# EAGLE design 14DoF (EAGLE 6.2)
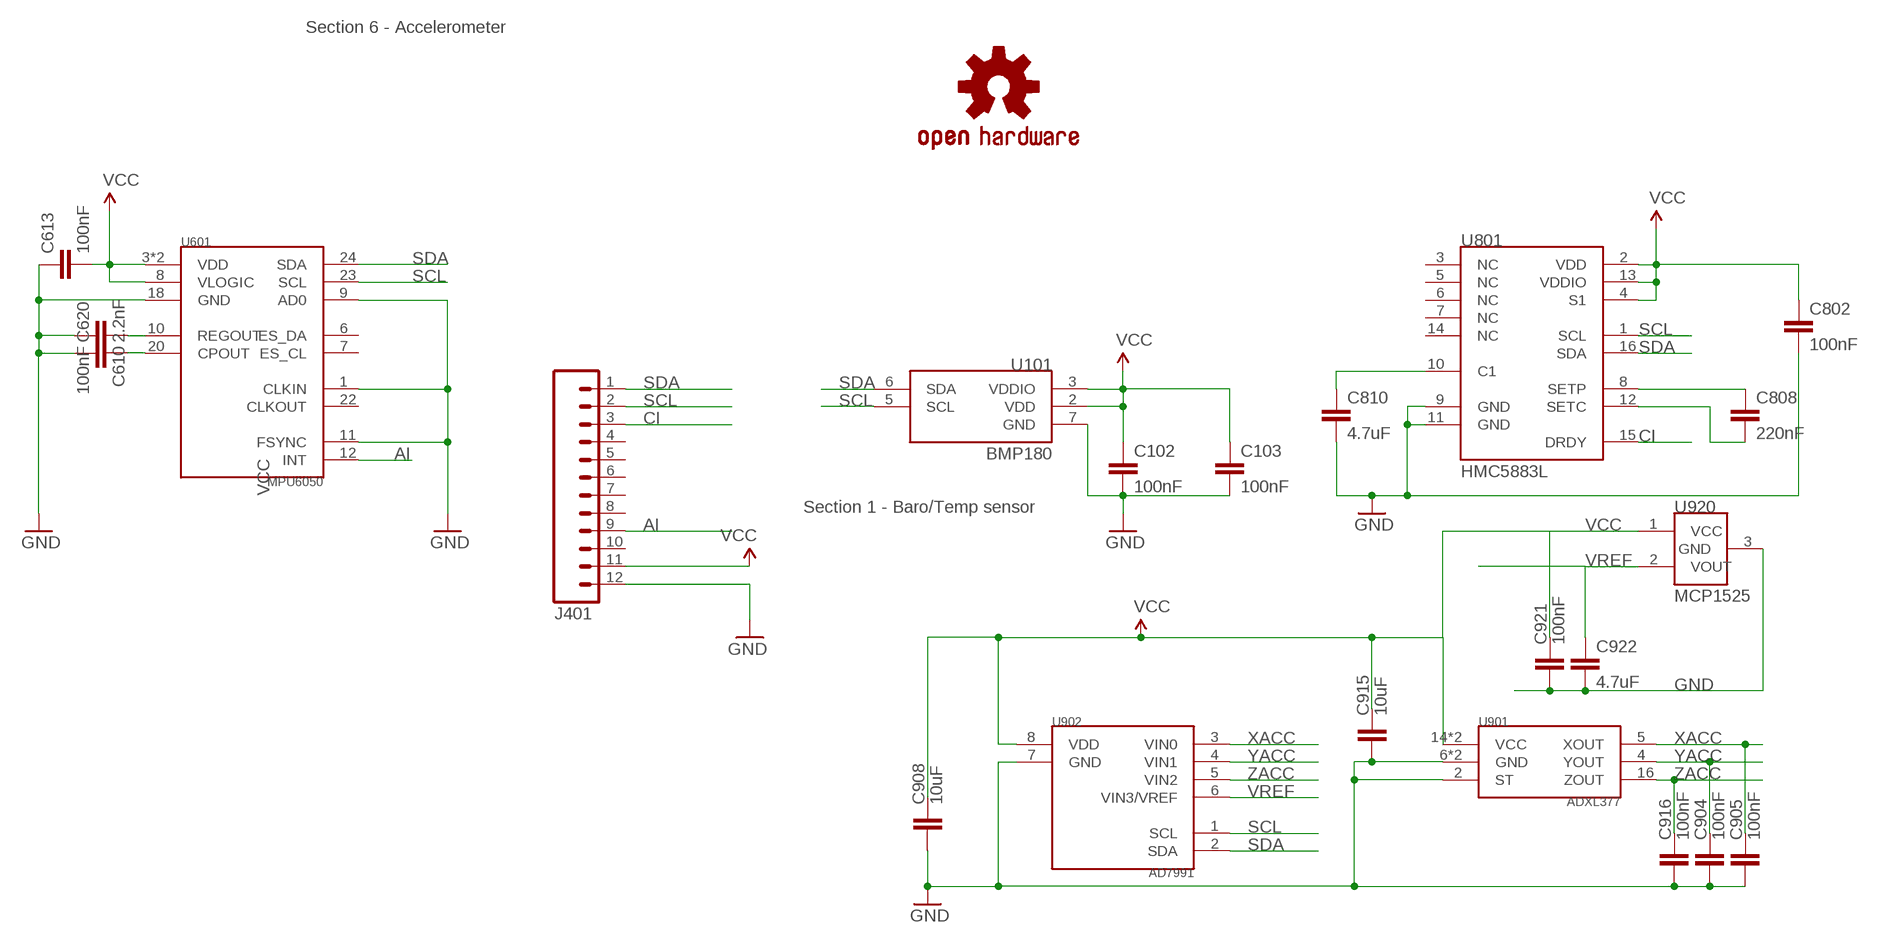
[diagram p0: schematic, sheet 1]

## Parts
C102  100nF  CAP0603-CAP  [0603-CAP]
C103  100nF  CAP0603-CAP  [0603-CAP]
C610  100nF  CAP0603-CAP  [0603-CAP]
C613  100nF  CAP0603-CAP  [0603-CAP]
C620  2.2nF  CAP0603-CAP  [0603-CAP]
C802  100nF  CAP0603-CAP  [0603-CAP]
C808  220nF  CAP0603-CAP  [0603-CAP]
C810  4.7uF  CAP0603-CAP  [0603-CAP]
C904  100nF  CAP0603-CAP  [0603-CAP]
C905  100nF  CAP0603-CAP  [0603-CAP]
C908  10uF  CAP0603-CAP  [0603-CAP]
C915  10uF  CAP0603-CAP  [0603-CAP]
C916  100nF  CAP0603-CAP  [0603-CAP]
C921  100nF  CAP0603-CAP  [0603-CAP]
C922  4.7uF  CAP0603-CAP  [0603-CAP]
J401  M12PTH  [1X12]
U101  BMP180  [BMP180]
U601  MPU6050  [MPU60X0]
U801  HMC5883L  HMC5883LSMD  [16LPCC]
U901  ADXL377  [ADXL377]
U902  AD7991  AD799X  [SOT-23-8]
U920  MCP1525  [SOT-23-3]
U$2  OSHW-LOGOS  [OSHW-LOGO-S]

## Nets
AI: J401.9 U601.12(INT)
CI: J401.3 U801.15(DRDY)
GND: C102.2 C103.2 C610.2 C613.1 C620.1 C802.2 C810.2 C904.2 C905.2 C908.2 C915.2 C916.2 C921.2 C922.2 J401.12 U101.7(GND) U601.1(CLKIN) U601.9(AD0) U601.11(FSYNC) U601.18(GND) U801.9(GND) U801.11(GND) U901.2(ST) U901.6(GND) U901.7(GND) U902.7(GND) U920.3(GND)
N$1: C610.1 U601.10(REGOUT)
N$3: C620.2 U601.20(CPOUT)
N$14: C808.1 U801.8(SETP)
N$15: C808.2 U801.12(SETC)
N$16: C810.1 U801.10(C1)
SCL: J401.2 U101.5(SCL) U601.23(SCL) U801.1(SCL) U902.1(SCL)
SDA: J401.1 U101.6(SDA) U601.24(SDA) U801.16(SDA) U902.2(SDA)
VCC [power]: C102.1 C103.1 C613.2 C802.1 C908.1 C915.1 C921.1 J401.11 U101.2(VDD) U101.3(VDDIO) U601.3(VDD) U601.8(VLOGIC) U601.13(VDD) U801.2(VDD) U801.4(S1) U801.13(VDDIO) U901.14(VCC) U901.15(VCC) U902.8(VDD) U920.1(VCC)
VREF: C922.1 U902.6(VIN3/VREF) U920.2(VOUT)
XACC: C905.1 U901.5(XOUT) U902.3(VIN0)
YACC: C904.1 U901.4(YOUT) U902.4(VIN1)
ZACC: C916.1 U901.16(ZOUT) U902.5(VIN2)
Unconnected: J401.4 J401.5 J401.6 J401.7 J401.8 J401.10 U601.6(ES_DA) U601.7(ES_CL) U601.22(CLKOUT) U801.3(NC) U801.5(NC) U801.6(NC) U801.7(NC) U801.14(NC)

## Notes on the sheet
- Section 6 - Accelerometer
- Section 1 - Baro/Temp sensor

## Library data of the parts
C102 C103 C610 C613 C802 C904 C905 C916 = SparkFun:CAP: Capacitor Standard 0603 ceramic capacitor, and 0.1" leaded capacitor.; DIGIKEY: 445-1316-1-ND
C620 = SparkFun:CAP: Capacitor Standard 0603 ceramic capacitor, and 0.1" leaded capacitor.; DIGIKEY: 445-1311-1-ND
C808 = SparkFun:CAP: Capacitor Standard 0603 ceramic capacitor, and 0.1" leaded capacitor.; DIGIKEY: 445-5132-1-ND
C810 = SparkFun:CAP: Capacitor Standard 0603 ceramic capacitor, and 0.1" leaded capacitor.; DIGIKEY: 445-7483-1-ND
C908 C915 = SparkFun:CAP: Capacitor Standard 0603 ceramic capacitor, and 0.1" leaded capacitor.; DIGIKEY: 445-7486-1-ND
C921 = SparkFun-Passives:CAP: Capacitor Standard 0603 ceramic capacitor, and 0.1" leaded capacitor.; DIGIKEY: 445-1265-1-ND
C922 = SparkFun-Passives:CAP: Capacitor Standard 0603 ceramic capacitor, and 0.1" leaded capacitor.; DIGIKEY: 445-7395-1-ND
J401 = SparkFun:M12: Header 12 Standard 12-pin 0.1" header. Use with straight break away headers (SKU : PRT-00116), right angle break away headers (PRT-00553), swiss pins (PRT-00743), machine pins (PRT-00117), and female headers (PRT-00115).; DIGIKEY: $NOPART
U101 = KwanSystems:BMP180; DIGIKEY: 828-1027-1-ND
U601 = KwanSystems:MPU6050: MPU6050 or MPU9150 Pin 3 is NC on the '6050, VDD on the '9150. Since pin 3 is not internally connected, a socket for the '9150 is compatible with a '6050.
U801 = SparkFun:HMC5883L: 3 Axis Digital Compass IC; DIGIKEY: 342-1082-1-ND
U901 = KwanSystems:ADXL377; DIGIKEY: ADXL377BCPZ-RL7CT-ND
U902 = KwanSystems:AD799X; DIGIKEY: AD7995YRJZ-1500RL7CT-ND
U920 = KwanSystems:MCP1525; DIGIKEY: MCP1525T-I/TTCT-ND
U$2 = SparkFun:OSHW-LOGO: Open Source Hardware Logo This logo indicates the piece of hardware it is found on incorporates a OSHW license and/or adheres to the definition of open source hardware found here: http://freedomdefined.org/OSHW; DIGIKEY: $NOPART

## Net classes
0 default: width 0.152 mm, drill 0.33 mm, clearance 0.152 mm
1 power: width 0.152 mm, drill 0.33 mm, clearance 0.152 mm to class 0, clearance 0.152 mm
2 hv: width 0.152 mm, drill 0.33 mm, clearance 0.152 mm

## Board
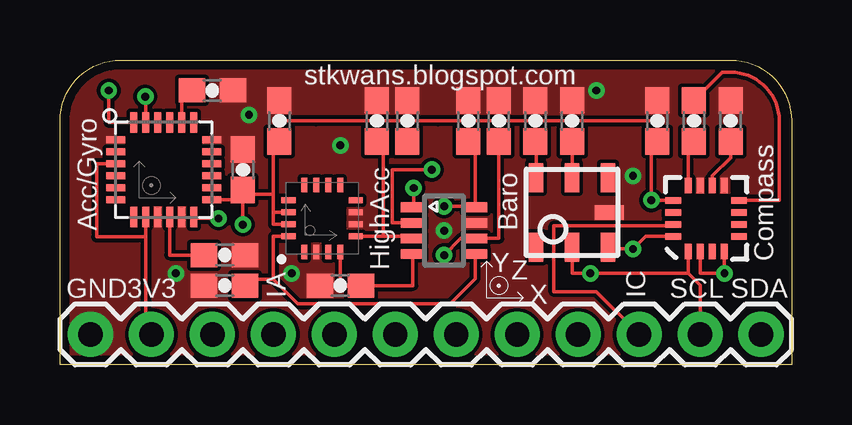
[diagram p1: board, top side]
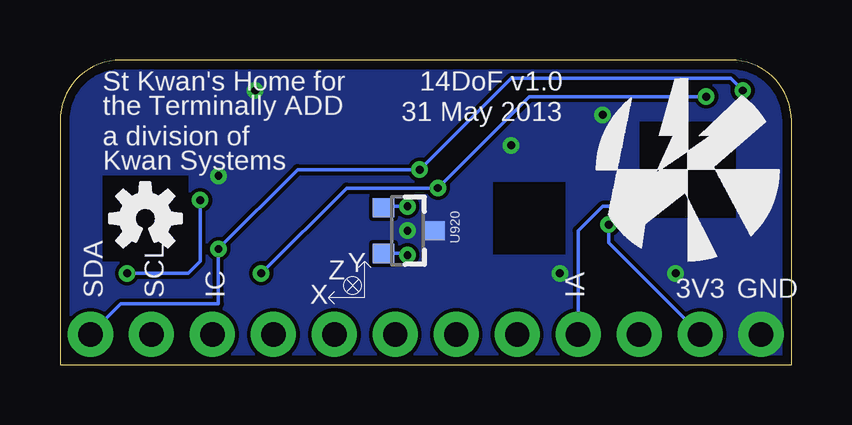
[diagram p2: board, bottom side, seen from below]

Size 30.48 x 12.7 mm. Coordinates in mm from the lower left corner, seen from the top.
Outline: 0,0 0,10.16 arc-90 2.54,12.7 27.94,12.7 arc-90 30.48,10.16 30.48,0 0,0
Copper layers (1*16): Top 0.0356mm / dielectric 1.5011mm / Bottom 0.0356mm
Design rules "default": minimum track width 6mil, minimum drill 13mil, track to track 6mil, track to pad 6mil, pad to pad 6mil, via to via 6mil, smd to smd 6mil, copper to edge 15mil, drill to drill 6mil, minimum pad ring 7mil, minimum via ring 7mil, stop-mask expansion 4mil, vias tented up to drill 14mil, thermal gap 10mil
tRestrict: area 25.1,7.1 to 25.9,7.9; area 27.9,7.1 to 28.7,7.9; area 27.9,4.3 to 28.7,5.1; area 25.1,4.3 to 25.9,5.1; area 25.9,5.1 to 27.9,7.1
bRestrict: area 25.1,4.3 to 28.7,7.9
vRestrict: area 0.8,2.8 to 1.8,4.8; area 3.3,2.8 to 4.3,4.8; area 5.8,2.8 to 6.9,4.8; area 8.4,2.8 to 9.4,3.8; area 10.9,2.8 to 11.7,5.3; area 12.7,2.8 to 15.2,3.6; area 13.5,3.6 to 14.2,5.3; area 15.5,2.8 to 18,3.6; area 18.5,2.8 to 19.6,3.8; area 20.6,2.8 to 22.6,3.6; area 21.1,3.6 to 21.8,4.8; area 23.6,2.8 to 24.4,3.8; 19 more areas

### Footprints (pad centres in the part's own frame; a part is rotated, then mirrored left to right if it is on the bottom)
0603-CAP = smd 1.1 x 1: 1 -0.85,0; 2 0.85,0
1X12 = drill 1.016 pad 1.88: 1 0,0; 2 2.54,0; 3 5.08,0; 4 7.62,0; 5 10.16,0; 6 12.7,0; 7 15.24,0; 8 17.78,0; 9 20.32,0; 10 22.86,0; 11 25.4,0; 12 27.94,0
BMP180 = smd 0.6 x 1.2: 1 1.5,1.45; 2 0,1.45; 3 -1.5,1.45; 4 -1.5,-1.45; 5 0,-1.45; 6 1.5,-1.45 | smd 1.2 x 0.6: 7 1.55,0
MPU60X0 = smd 0.8 x 0.3: 1 -2,1.25; 2 -2,0.75; 3 -2,0.25; 4 -2,-0.25; 5 -2,-0.75; 6 -2,-1.25; 13 2,-1.25; 14 2,-0.75; 15 2,-0.25; 16 2,0.25; 17 2,0.75; 18 2,1.25 | smd 0.3 x 0.85: 7 -1.25,-1.975; 8 -0.75,-1.975; 9 -0.25,-1.975; 10 0.25,-1.975; 11 0.75,-1.975; 12 1.25,-1.975; 19 1.25,1.975; 20 0.75,1.975; 21 0.25,1.975; 22 -0.25,1.975; 23 -0.75,1.975; 24 -1.25,1.975
16LPCC = smd 0.65 x 0.28: 1 -1.37,0.75; 2 -1.37,0.25; 3 -1.37,-0.25; 4 -1.37,-0.75; 9 1.37,-0.75; 10 1.37,-0.25; 11 1.37,0.25; 12 1.37,0.75 | smd 0.28 x 0.65: 5 -0.75,-1.37; 6 -0.25,-1.37; 7 0.25,-1.37; 8 0.75,-1.37; 13 0.75,1.37; 14 0.25,1.37; 15 -0.25,1.37; 16 -0.75,1.37
ADXL377 = smd 0.6 x 0.25: 1 -1.4,0.75; 2 -1.4,0.25; 3 -1.4,-0.25; 4 -1.4,-0.75; 9 1.4,-0.75; 10 1.4,-0.25; 11 1.4,0.25; 12 1.4,0.75 | smd 0.25 x 0.6: 5 -0.75,-1.4; 6 -0.25,-1.4; 7 0.25,-1.4; 8 0.75,-1.4; 13 0.75,1.4; 14 0.25,1.4; 15 -0.25,1.4; 16 -0.75,1.4
SOT-23-8 = smd 0.4 x 1: 1 -0.975,-1.3; 2 -0.325,-1.3; 3 0.325,-1.3; 4 0.975,-1.3; 5 0.975,1.3; 6 0.325,1.3; 7 -0.325,1.3; 8 -0.975,1.3
SOT-23-3 = smd 0.9 x 0.8: 1 -1,0.95; 2 -1,-0.95; 3 1.1,0

### Placement (x,y rotation side)
C102  21.34,10.16 90 top
C103  19.81,10.16 90 top
C610  6.86,4.57 0 top
C613  7.62,8.13 270 top
C620  6.35,11.43 180 top
C802  24.89,10.16 90 top
C808  26.42,10.16 270 top
C810  27.94,10.16 90 top
C904  11.68,3.3 180 top
C905  13.21,10.16 90 top
C908  14.48,10.16 90 top
C915  9.14,10.16 90 top
C916  6.86,3.3 180 top
C921  17.02,10.16 90 top
C922  18.29,10.16 90 top
J401  29.21,1.27 180 top
U101  21.34,6.35 0 top
U601  4.32,8.13 0 top
U801  26.92,6.1 90 top
U901  10.92,6.1 90 top
U902  16,5.59 270 top
U920  16,5.59 0 bottom
U$1  [KWAN_ACC]  4.32,8.13 0 bottom
U$2  26.92,6.1 0 bottom
U$3  [AXES_SM]  17.78,2.79 0 top

### Tracks (layer width: path | path; a pad name or v marks a point on that pad's centre or on a via)
AI  (via drill 0.33)
  Top 0.152: U601.12 5.62,6.1 v6.6,6.1
  Bottom 0.152: v6.6,6.1 7.11,6.6 7.87,6.6 8.89,5.59 J401.9
CI
  Top 0.152: J401.3 22.35,3.05 20.57,3.05 20.57,5.79 25.5,5.79 U801.15
GND  (via drill 0.33)
  other vias: 4.83,3.81 11.68,9.14 22.35,11.43 16,5.59 9.65,3.81 7.87,10.41 23.88,7.87
  pour Top (no thermals): 2.54,12.7 27.94,12.7 arc-90 30.48,10.16 30.48,0 0,0 0,10.16 arc-90
  pour Bottom (no thermals): 2.54,12.7 27.94,12.7 arc-90 30.48,10.16 30.48,0 0,0 0,10.16 arc-90
N$1
  Top 0.152: U601.10 4.57,4.57 C610.1
N$3
  Top 0.152: U601.20 5.07,11.43 C620.2
N$14
  Top 0.152: C808.1 27.6,12.19 27.94,12.19 arc-90 29.97,10.16 29.97,6.85 U801.8
N$15
  Top 0.152: U801.12 26.17,9.07 C808.2
N$16
  Top 0.152: U801.10 27.17,7.87 27.94,8.64 C810.1
SCL  (via drill 0.33)
  Top 0.152: 26.17,3.81 v22.1,3.81 21.34,3.81 U101.5 21.41,4.83 | 26.17,3.81 U801.1 | J401.2 26.67,3.31 26.17,3.81 | U601.23 3.57,11.16 v3.56,11.18 | U902.1 14.73,6.56 v14.73,7.37
  Bottom 0.152: v3.56,11.18 10.92,11.18 v14.73,7.37 18.54,7.37 v22.1,3.81
SDA  (via drill 0.33)
  Top 0.152: U801.16 24.4,5.35 v23.88,4.83 22.84,4.83 U101.6 | v2.03,11.43 2.03,10.1 U601.24 | v15.49,8.13 13.84,8.13 13.84,5.91 U902.2
  Bottom 0.152: J401.1 27.94,2.54 23.88,2.54 v23.88,4.83 20.57,8.13 v15.49,8.13 11.68,11.94 2.54,11.94 v2.03,11.43
VCC  (via drill 0.33)
  Top 0.152: U101.2 C102.1 21.34,10.16 | U101.3 19.84,9.29 arc90 C103.1 19.81,10.16 | 19.81,10.16 21.34,10.16 | 21.34,10.16 24.89,10.16 C802.1 24.64,9.06 v24.64,6.86 24.65,6.85 U801.13 | v7.62,5.84 7.62,6.88 | 7.62,6.88 C613.2 | U901.15 8.89,5.85 8.89,6.35 | U601.13 7.62,6.88 | 8.89,7.11 8.89,9.14 8.98,9.14 C915.1 9.14,10.16 10.67,10.16 14.48,10.16 | 19.81,10.16 17.02,10.16 | 17.02,10.16 15.75,10.16 14.48,10.16 | U801.4 27.67,3.82 v27.69,3.81 26.67,3.81 U801.2 | U601.8 3.57,5.33 | 3.57,5.33 3.57,1.27 J401.11 | 7.62,6.88 7.85,7.11 8.89,7.11 | C908.1 14.48,10.16 | U601.3 1.52,8.38 1.52,5.33 3.57,5.33 | C921.1 17.02,10.16 | C921.1 17,9.29 | C921.1 17.3,9.03 U902.8 17.26,6.6 v16,6.6 | 8.89,7.11 8.89,6.35 | U901.14 8.89,6.35
  Bottom 0.152: v27.69,3.81 25.15,3.81 24.64,4.32 v24.64,6.86 | J401.11 7.62,5.08 v7.62,5.84 | v16,6.6 16.94,6.6 arc-90 U920.1
VREF  (via drill 0.33)
  Top 0.152: v16,4.57 16.69,5.26 U902.6 18.29,5.26 C922.1
  Bottom 0.152: U920.2 16,4.64 v16,4.57
XACC
  Top 0.152: U901.5 13.46,5.35 | C905.1 13.46,9.31 13.46,5.35 | 13.46,5.35 14.7,5.35 U902.3
YACC
  Top 0.152: U901.4 11.67,3.3 C904.1 14.7,3.3 U902.4 14.7,4.7
ZACC
  Top 0.152: U901.16 8.89,5.35 8.89,3.56 | 8.89,3.56 7.71,3.56 C916.1 | 8.89,3.56 9.91,2.54 16.26,2.54 17.3,3.59 U902.5

### Text on the board
tPlace: stkwans.blogspot.com | Acc/Gyro | Baro | HighAcc | Compass | GND | 3V3 | IA | IC | SCL | SDA
bPlace: 14DoF v1.0 | St Kwan's Home for | 31 May 2013 | the Terminally ADD | a division of | Kwan Systems | GND | 3V3 | IA | IC | SCL | SDA